# Altium schematic sheet 27_PP0_GPP, SPI.SchDoc
size 419 x 296 mm; Author: Serbinov O.A.; CompanyName: ELSICOM; DrawnBy: Serbinov O.A.; Engineer: Serbinov O.A.; Organization: Elsicom; Address1: Kirova avenue, 58; Address2: Tomsk; Address3: Russia 634012; DocumentNumber: 28; SheetNumber: 28; SheetTotal: 44; ProjectName: 48_PORTS
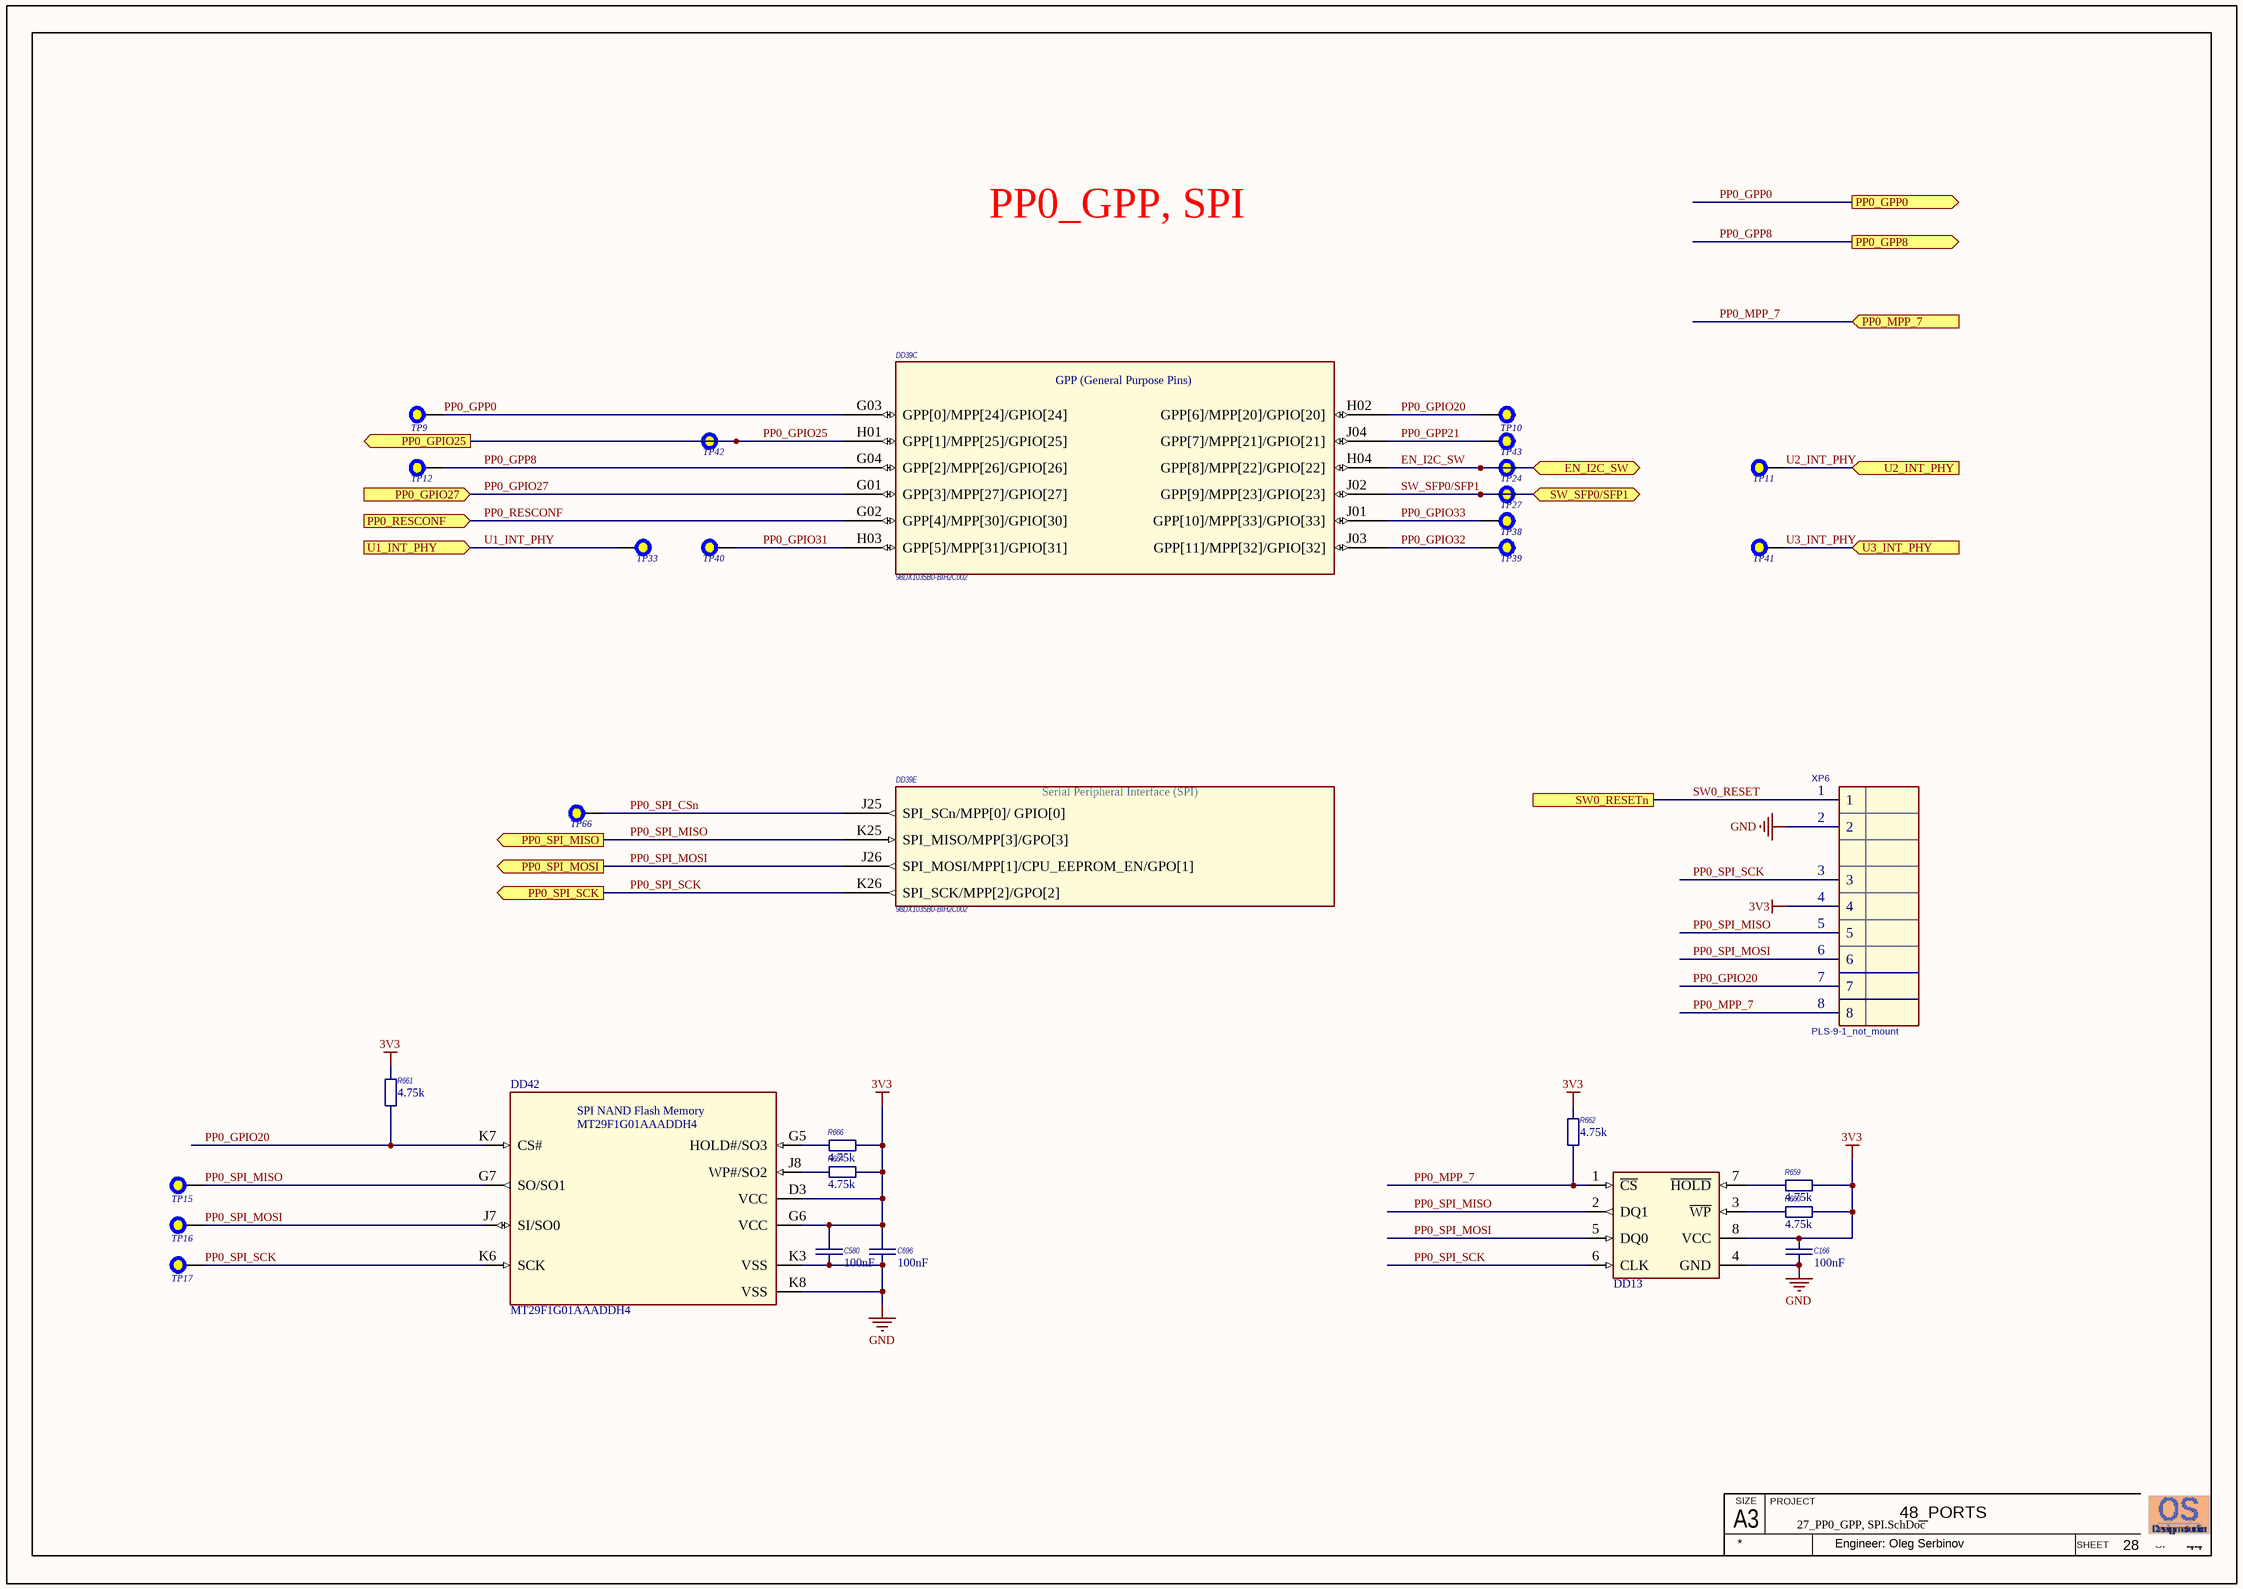
[diagram p0: 27_PP0_GPP, SPI.SchDoc]

## Parts
C166  Capacitance: 100nF  [C0402_IPC High Density]  (hidden comment: GRM155R71E104KE14D)
C580  Capacitance: 100nF  [C0402_IPC High Density]  (hidden comment: GRM155R71E104KE14D)
C696  Capacitance: 100nF  [C0402_IPC High Density]  (hidden comment: GRM155R71E104KE14D)
DD13  M25P16-VMN6P  [SO-8_L]  (value not drawn)
DD39  98DX1035B0-BIH2C002  [HSBGA617_27X27_1MM]  (parts C,E of 16)
DD42  MT29F1G01AAADDH4  [VFBGA 63-Ball]
R659  Resistance (Ohms): 4.75k  [R0402_IPC High Density]  (hidden comment: ERJ-2RKF4751X)
R660  Resistance (Ohms): 4.75k  [R0402_IPC High Density]  (hidden comment: ERJ-2RKF4751X)
R661  Resistance (Ohms): 4.75k  [R0402_IPC High Density]  (hidden comment: ERJ-2RKF4751X)
R662  Resistance (Ohms): 4.75k  [R0402_IPC High Density]  (hidden comment: ERJ-2RKF4751X)
R664  Resistance (Ohms): 4.75k  [R0402_IPC High Density]  (hidden comment: ERJ-2RKF4751X)
R666  Resistance (Ohms): 4.75k  [R0402_IPC High Density]  (hidden comment: ERJ-2RKF4751X)
TP9  Test Point 0.5mm pad  [Test Point 0.5mm]  (value not drawn)  (no BOM)
TP10  Test Point 0.5mm pad  [Test Point 0.5mm]  (value not drawn)  (no BOM)
TP11  Test Point 0.5mm pad  [Test Point 0.5mm]  (value not drawn)  (no BOM)
TP12  Test Point 0.5mm pad  [Test Point 0.5mm]  (value not drawn)  (no BOM)
TP15  Test Point 0.5mm pad  [Test Point 0.5mm]  (value not drawn)  (no BOM)
TP16  Test Point 0.5mm pad  [Test Point 0.5mm]  (value not drawn)  (no BOM)
TP17  Test Point 0.5mm pad  [Test Point 0.5mm]  (value not drawn)  (no BOM)
TP24  Test Point 0.5mm pad  [Test Point 0.5mm]  (value not drawn)  (no BOM)
TP27  Test Point 0.5mm pad  [Test Point 0.5mm]  (value not drawn)  (no BOM)
TP33  Test Point 0.5mm pad  [Test Point 0.5mm]  (value not drawn)  (no BOM)
TP38  Test Point 0.5mm pad  [Test Point 0.5mm]  (value not drawn)  (no BOM)
TP39  Test Point 0.5mm pad  [Test Point 0.5mm]  (value not drawn)  (no BOM)
TP40  Test Point 0.5mm pad  [Test Point 0.5mm]  (value not drawn)  (no BOM)
TP41  Test Point 0.5mm pad  [Test Point 0.5mm]  (value not drawn)  (no BOM)
TP42  Test Point 0.5mm pad  [Test Point 0.5mm]  (value not drawn)  (no BOM)
TP43  Test Point 0.5mm pad  [Test Point 0.5mm]  (value not drawn)  (no BOM)
TP66  Test Point 0.5mm pad  [Test Point 0.5mm]  (value not drawn)  (no BOM)
XP6  PLS-9-1_not_mount  [PLS-9-1]

## Ports
EN_I2C_SW (bidir), PP0_GPIO25 (out), PP0_GPIO27 (in), PP0_GPP0 (out), PP0_GPP8 (out), PP0_MPP_7 (in), PP0_RESCONF (in), PP0_SPI_MISO (out), PP0_SPI_MOSI (out), PP0_SPI_SCK (out), SW0_RESETn, SW_SFP0/SFP1 (bidir), U1_INT_PHY (in), U2_INT_PHY (in), U3_INT_PHY (in)

## Nets
3V3: C166.1 C580.1 C696.1 DD13.8(VCC) DD42.D3(VСС) DD42.G6(VCC) R659.2 R660.2 R661.1 R662.1 R664.1 R666.1 XP6.4
GND: C166.2 C580.2 C696.2 DD13.4(GND) DD42.K3(VSS) DD42.K8(VSS) XP6.2
EN_I2C_SW: DD39.H04(GPP[8]/MPP[22]/GPIO[22]) TP24.1 ; port EN_I2C_SW
PP0_GPIO20: DD39.H02(GPP[6]/MPP[20]/GPIO[20]) DD42.K7(CS#) R661.2 TP10.1 XP6.7
PP0_GPIO25: DD39.H01(GPP[1]/MPP[25]/GPIO[25]) TP42.1 ; port PP0_GPIO25
PP0_GPIO27: DD39.G01(GPP[3]/MPP[27]/GPIO[27]) ; port PP0_GPIO27
PP0_GPIO31: DD39.H03(GPP[5]/MPP[31]/GPIO[31]) TP40.1
PP0_GPIO32: DD39.J03(GPP[11]/MPP[32]/GPIO[32]) TP39.1
PP0_GPIO33: DD39.J01(GPP[10]/MPP[33]/GPIO[33]) TP38.1
PP0_GPP0: DD39.G03(GPP[0]/MPP[24]/GPIO[24]) TP9.1 ; port PP0_GPP0
PP0_GPP8: DD39.G04(GPP[2]/MPP[26]/GPIO[26]) TP12.1 ; port PP0_GPP8
PP0_GPP21: DD39.J04(GPP[7]/MPP[21]/GPIO[21]) TP43.1
PP0_MPP_7: DD13.1(~{CS}) R662.2 XP6.8 ; port PP0_MPP_7
PP0_RESCONF: DD39.G02(GPP[4]/MPP[30]/GPIO[30]) ; port PP0_RESCONF
PP0_SPI_CSn: DD39.J25(SPI_SCn/MPP[0]/_GPIO[0]) TP66.1
PP0_SPI_MISO: DD13.2(DQ1) DD39.K25(SPI_MISO/MPP[3]/GPO[3]) DD42.G7(SO/SO1) TP15.1 XP6.5 ; port PP0_SPI_MISO
PP0_SPI_MOSI: DD13.5(DQ0) DD39.J26(SPI_MOSI/MPP[1]/CPU_EEPROM_EN/GPO[1]) DD42.J7(SI/SO0) TP16.1 XP6.6 ; port PP0_SPI_MOSI
PP0_SPI_SCK: DD13.6(CLK) DD39.K26(SPI_SCK/MPP[2]/GPO[2]) DD42.K6(SCK) TP17.1 XP6.3 ; port PP0_SPI_SCK
SW0_RESET: XP6.1 ; port SW0_RESETn
SW_SFP0/SFP1: DD39.J02(GPP[9]/MPP[23]/GPIO[23]) TP27.1 ; port SW_SFP0/SFP1
U1_INT_PHY: TP33.1 ; port U1_INT_PHY
U2_INT_PHY: TP11.1 ; port U2_INT_PHY
U3_INT_PHY: TP41.1 ; port U3_INT_PHY
NetDD13_3: DD13.3(~{WP}) R660.1
NetDD13_7: DD13.7(~{HOLD}) R659.1
NetDD42_G5: DD42.G5(HOLD#/SO3) R666.2
NetDD42_J8: DD42.J8(WP#/SO2) R664.2

## Notes on the sheet
- PP0_GPP, SPI
- A3
- SIZE
- PROJECT
- SHEET
- OF
- Engineer: Oleg Serbinov
- (in symbol 98DX1035A1-BIH2C002, part C) GPP (General Purpose Pins)
- (in symbol 98DX1035A1-BIH2C002, part E) Serial Peripheral Interface (SPI)
- (in symbol MT29F1G01AAADDH4) SPI NAND Flash Memory

## Library data of the parts
C166 C580 C696 = GRM155R71E104KE14D: C0402, 100nF, 25V, X7R; Manufacturer: Murata; Rmanufacturer: Yageo  Samsung  TDK  Taiyo Yuden  Kemet; Customer Part Number: Конденсатор, 100n, 0402, 25V, X7R, 10%; Capacitance Tolerance: ± 10%; Voltage Rating: 16; Capacitor Case Style: 0402 [1005 Metric]; Capacitor Terminals: SMD; SVHC: No SVHC (19-Dec-2012); No. of Pins: 2; Reel Quantity: 10000; Tolerance +: 10%; Analogs: any suitable; Manufacturer Part Number: GRM155R71E104KE14D; RoHS: YES; Packaging: Reel; Package / Case: 0402; ComponentLink1URL: http://www.farnell.com/datasheets/4360.pdf; ComponentLink1Description: http://www.farnell.com/datasheets/4360.pdf; Pricing: 10000=0.008593, 30000=0.007991 (GBP); Supplier 1: Farnell; Supplier Part Number 1: 1118151; Stock: 3; Dielectric Characteristic: X7R; Operating Temperature Min: -55; Operating Temperature Max: 125; Operating Temperature Range: -55°C to +125; Series: GRM Hi-Cap; Terminal Type: Surface Mount (SMD, SMT); Tolerance -: 10%; Voltage Rating V DC: 16
DD13 = M25P16-VMN6P: NOR Flash Serial-SPI 3.3V 16Mbit 2M x 8bit 1 8-Pin SO N; Customer Part Number: Микросхема, M25P16-VMN6P, IC FLASH 16MBIT 75MHZ, 8-SO; Manufacturer: Micron Technology Inc.; Manufacturer Part Number: M25P16-VMN6P
DD39 = 98DX1035A1-BIH2C002: IC 24-PORT FE  4-PORT 2.5GE L2 ENTRY-LEVEL, CPU; Customer Part Number: Микросхема, 98DX1035B0-BIH2C002, IC 24-PORT FE 4-PORT 2.5GE L2 ENTRY-LEVEL, HSBGA617SBGA617; Manufacturer: Marvell Technology Group; Manufacturer Part Number: 98DX1035B0-BIH2C002
DD42 = MT29F1G01AAADDH4: IC 1Gb x1: SPI NAND Flash Memory; Manufacturer: Micron Technology Inc; Customer Part Number: Микросхема, MT29F1G01AAADDH4, IC FLASH 1GBIT, 63-VFBGA; Description 1: IC FLASH SRL NAND 1GB 63VFBGA; Category 1: Integrated Circuits (ICs); Memory Type: FLASH - NAND; Memory Size: 1G (1G x 1); Interface: SPI Serial; Voltage - Supply: 2.7 V ~ 3.6 V; Supplier 1: Digi-Key; Supplier Part Number 1: MT29F1G01AAADDH4:D-ND; RoHS 1: RoHS Compliant; Stock 1: 0; Pricing 1: 1000=3.08246 (USD); Format - Memory: FLASH; Speed: -; Operating Temperature: 0°C ~ 70°C; Package / Case: 63-VFBGA; Supplier Device Package: 63-VFBGA (9x11); Packaging: Bulk; Category: Integrated Circuits (ICs); Supplier: Digi-Key; Supplier Part Number: MT29F1G01AAADDH4:D-ND; RoHS: RoHS Compliant; Manufacturer Part Number: MT29F1G01AAADDH4
R659-R662 R664 R666 = ERJ-2RKF4751X: R0402, 4.75k 1%; Manufacturer: Panasonic; Rpart number: RC0402FR-074K75L ; RC1005F4751CS ; RMCF0402FT4K75 ; CRCW04024K75FKED ; TRR01MZPF4751; Rmanufacturer: Yageo  Samsung  Stackpole Electronics  Rohm Semiconductor  Vishay Dale; Customer Part Number: Резистор, 4K75, 0402, 1%; Temperature Coefficient: ±100ppm/°C; Power (Watts): 0.1W, 1/10W; Analogs: any suitable; Tolerance: ±1%; Packaging: Cut Tape (CT); Package / Case: 0402 (1005 Metric); Category: Resistors; Manufacturer Part Number: ERJ-2RKF4751X; Supplier Part Number: P4.75KLCT-ND; RoHS: RoHS Compliant; Supplier: Digi-Key; ComponentLink1URL: http://industrial.panasonic.com/www-cgi/jvcr13pz.cgi?E+PZ+3+AOA0002+ERJ2RKF4751X+7+WW; ComponentLink1Description: http://industrial.panasonic.com/www-cgi/jvcr13pz.cgi?E+PZ+3+AOA0002+ERJ2RKF4751X+7+WW; Features: -; Composition: Thick Film; Height: 0.016" (0.40mm); Number of Terminations: 2; Supplier Device Package: 0402; Size / Dimension: 0.039" L x 0.020" W (1.00mm x 0.50mm)
XP6 = PLS-9-1_not_mount: Connector PLS-9 (pin 3 is removed); Customer Part Number: Разъем, PLS-9-1, 9 Positions Header pin 3 is removed,  2.54mm Through Hole Tin-Lead; Analogs: any suitable; Manufacturer Part Number: PLS-9-1_not_mount; Notes: not_mount